# Altium schematic sheet stm32.SchDoc
size A4
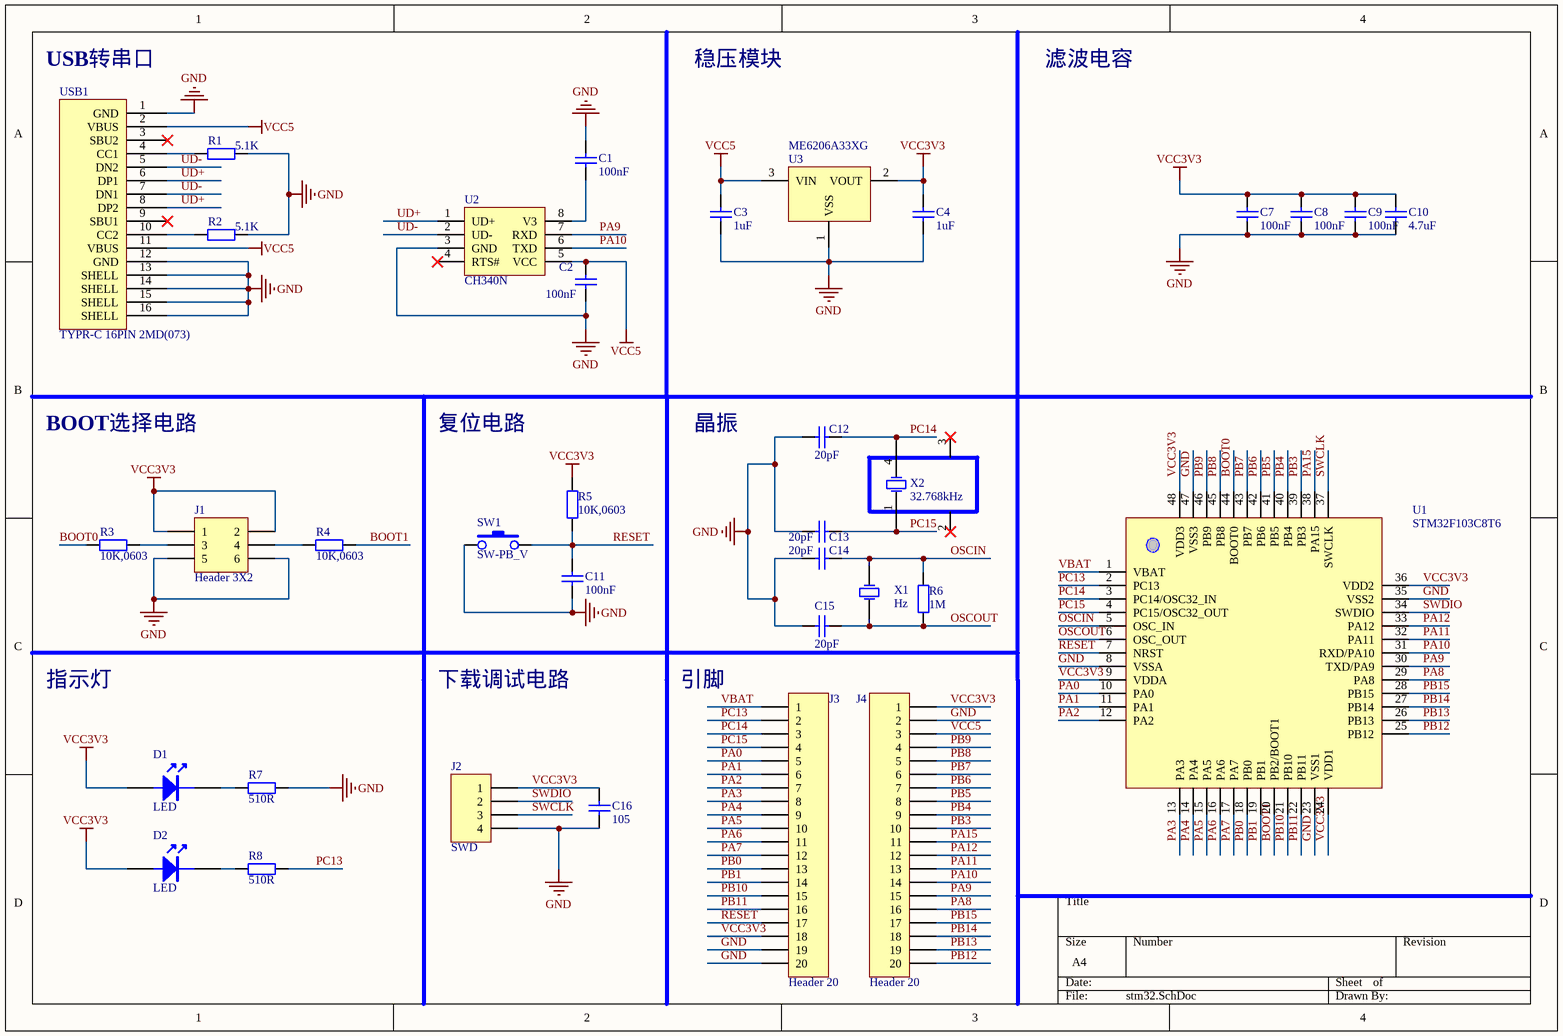
[diagram p0: stm32.SchDoc]

## Parts
C1  100nF  [C0603]
C2  100nF  [C0603]
C3  1uF  [C0603]
C4  1uF  [C0603]
C7  100nF  [C0603]
C8  100nF  [C0603]
C9  100nF  [C0603]
C10  4.7uF  [C0603]
C11  100nF  [C0603]
C12  20pF  [C0603]
C13  20pF  [C0603]
C14  20pF  [C0603]
C15  20pF  [C0603]
C16  105  [C0603]
D1  LED  [LED]
D2  LED  [LED]
J1  Header 3X2  [HDR2X3]
J2  SWD  [HDR1X4H]
J3  Header 20  [HDR1X20]
J4  Header 20  [HDR1X20]
R1  5.1K  [R0603]
R2  5.1K  [R0603]
R3  10K,0603  [R0603]
R4  10K,0603  [R0603]
R5  10K,0603  [R0603]
R6  1M  [R0603]
R7  510R  [R0603]
R8  510R  [R0603]
SW1  SW-PB_V  [KET-SMT-2]
U1  STM32F103C8T6  [48P]
U2  CH340N  [SOP_8(OPA)]
U3  ME6206A33XG  [SOT-23-3]
USB1  TYPR-C 16PIN 2MD(073)  [Type-C_USB]
X1  Hz  [XTAL1]
X2  32.768kHz  [MC-306]

## Nets
GND: C1.1 C2.1 C3.1 C4.1 C7.2 C8.2 C9.2 C10.2 C11.1 C12.1 C13.1 C14.1 C15.1 C16.1 J1.5 J1.6 J2.4 J3.19 J3.20 J4.2 R1.1 R2.1 R7.2 SW1.1 U1.8(VSSA) U1.23(VSS1) U1.35(VSS2) U1.47(VSS3) U2.3(GND) U3.1(VSS) USB1.1(GND) USB1.12(GND) USB1.13(SHELL) USB1.14(SHELL) USB1.15(SHELL) USB1.16(SHELL)
VCC3V3: C4.2 C7.1 C8.1 C9.1 C10.1 C16.2 D1.A D2.A J1.1 J1.2 J2.1 J3.18 J4.1 R5.2 U1.9(VDDA) U1.24(VDD1) U1.36(VDD2) U1.48(VDD3) U3.2(VOUT)
VCC5: C2.2 C3.2 J4.3 U2.5(VCC) U3.3(VIN) USB1.2(VBUS) USB1.11(VBUS)
BOOT0: R3.1 U1.44(BOOT0)
BOOT1: R4.2 U1.20(PB2/BOOT1)
OSCIN: C14.2 R6.2 U1.5(OSC_IN) X1.2
OSCOUT: C15.2 R6.1 U1.6(OSC_OUT) X1.1
PA0: J3.5 U1.10(PA0)
PA1: J3.6 U1.11(PA1)
PA2: J3.7 U1.12(PA2)
PA3: J3.8 U1.13(PA3)
PA4: J3.9 U1.14(PA4)
PA5: J3.10 U1.15(PA5)
PA6: J3.11 U1.16(PA6)
PA7: J3.12 U1.17(PA7)
PA8: J4.16 U1.29(PA8)
PA9: J4.15 U1.30(TXD/PA9) U2.7(RXD)
PA10: J4.14 U1.31(RXD/PA10) U2.6(TXD)
PA11: J4.13 U1.32(PA11)
PA12: J4.12 U1.33(PA12)
PA15: J4.11 U1.38(PA15)
PB0: J3.13 U1.18(PB0)
PB1: J3.14 U1.19(PB1)
PB3: J4.10 U1.39(PB3)
PB4: J4.9 U1.40(PB4)
PB5: J4.8 U1.41(PB5)
PB6: J4.7 U1.42(PB6)
PB7: J4.6 U1.43(PB7)
PB8: J4.5 U1.45(PB8)
PB9: J4.4 U1.46(PB9)
PB10: J3.15 U1.21(PB10)
PB11: J3.16 U1.22(PB11)
PB12: J4.20 U1.25(PB12)
PB13: J4.19 U1.26(PB13)
PB14: J4.18 U1.27(PB14)
PB15: J4.17 U1.28(PB15)
PC13: J3.2 R8.2 U1.2(PC13)
PC14: C12.2 J3.3 U1.3(PC14/OSC32_IN) X2.4
PC15: C13.2 J3.4 U1.4(PC15/OSC32_OUT) X2.1
RESET: C11.2 J3.17 R5.1 SW1.2 U1.7(NRST)
SWCLK: J2.3 U1.37(SWCLK)
SWDIO: J2.2 U1.34(SWDIO)
UD+: U2.1(UD+) USB1.6(DP1) USB1.8(DP2)
UD-: U2.2(UD-) USB1.5(DN2) USB1.7(DN1)
VBAT: J3.1 U1.1(VBAT)
NetC1_2: C1.2 U2.8(V3)
NetD1_K: D1.K R7.1
NetD2_K: D2.K R8.1
NetJ1_3: J1.3 R3.2
NetJ1_4: J1.4 R4.1
NetR1_2: R1.2 USB1.4(CC1)
NetR2_2: R2.2 USB1.10(CC2)

Not connected (* = marked no-connect by the designer): U2 4(RTS#)*; USB1 3(SBU2)* 9(SBU1)*; X2 2* 3*

## Notes on the sheet
- (near USB1) USB转串口
- 稳压模块
- 滤波电容
- BOOT选择电路
- 复位电路
- 晶振
- 指示灯
- 下载调试电路
- 引脚

## Library data of the parts
C1-C4 C7-C16 = Cap_1: Capacitor; Value: 104; Published: 8-Jun-2000; LatestRevisionDate: 17-Jul-2002; LatestRevisionNote: Re-released for DXP Platform.; Publisher: Altium Limited
D1 D2 = LED_1: pin to pad: A>1 K>2
J1 = Header 3X2_1: Header, 3-Pin, Dual row; LatestRevisionDate: 17-Jul-2002; LatestRevisionNote: Re-released for DXP Platform.; Publisher: Altium Limited
J2 = Header 4_1: Header, 4-Pin; LatestRevisionDate: 17-Jul-2002; LatestRevisionNote: Re-released for DXP Platform.; Publisher: Altium Limited
J3 J4 = Header 20_1: Header, 20-Pin; LatestRevisionDate: 17-Jul-2002; LatestRevisionNote: Re-released for DXP Platform.; Publisher: Altium Limited
R1-R6 = Res_1: Resistor; Published: 8-Jun-2000; LatestRevisionDate: 17-Jul-2002; LatestRevisionNote: Re-released for DXP Platform.; Publisher: Altium Limited
R7 R8 = Res_1: Resistor  510Ω; Published: 8-Jun-2000; LatestRevisionDate: 17-Jul-2002; LatestRevisionNote: Re-released for DXP Platform.; Publisher: Altium Limited
SW1 = SW-PB_V: SWITCH
U2 = CH340N: USB转串口芯片
U3 = ME6206A33XG: 3.3稳压
USB1 = USB: TYPE-C-16PIN
X1 = XTAL: 晶振
X2 = XTAL_2: 晶振 32.768kHz